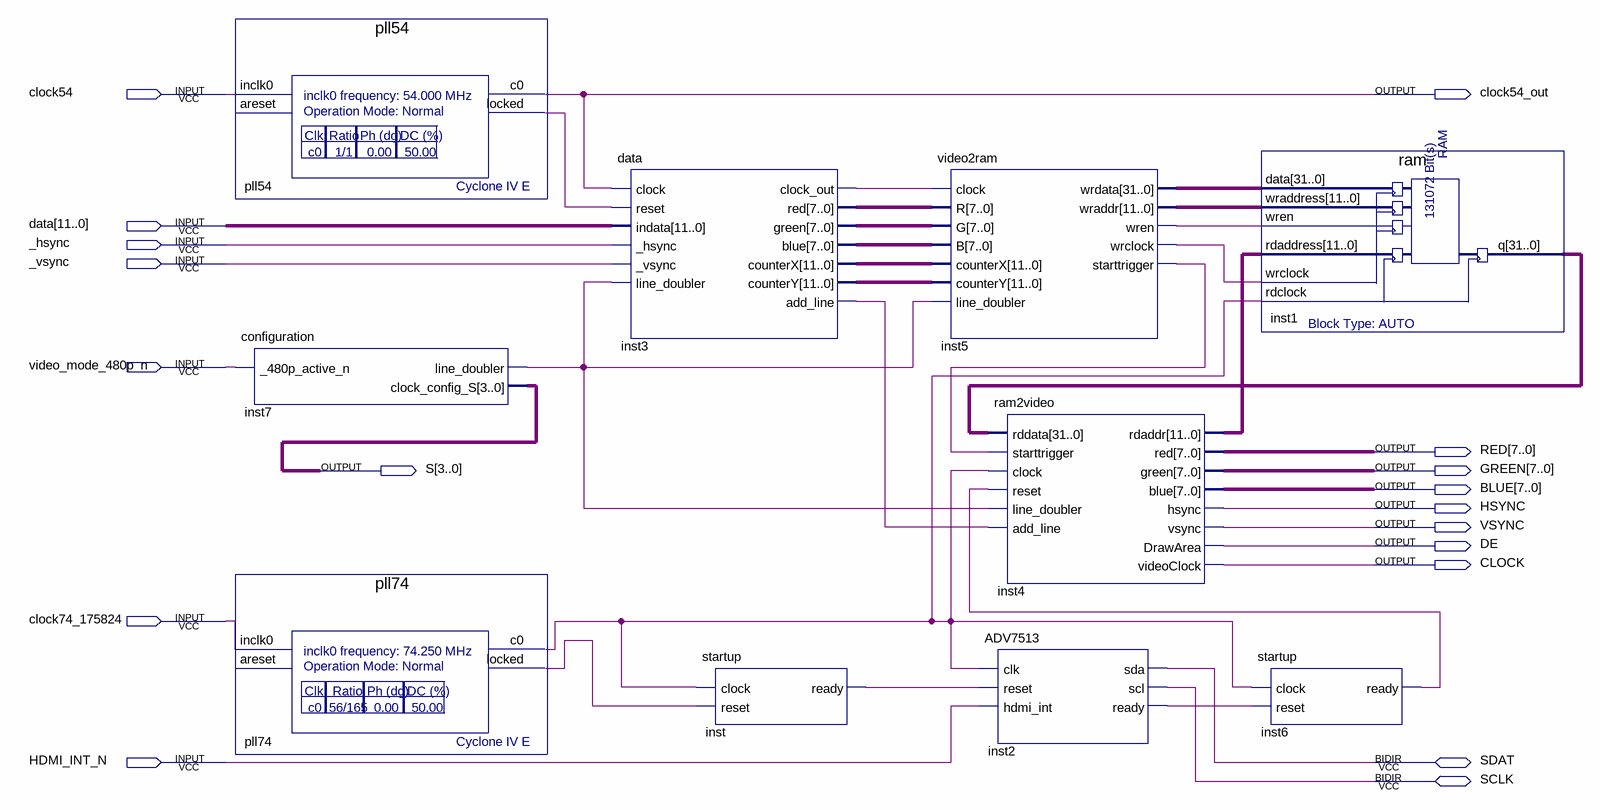
[diagram p0: schematic sheet]
// Quartus schematic DCxPlus.bdf as structural Verilog: 10 symbols, 18 pins
module DCxPlus (
  input  clock54,
  input  [11:0] data,
  input  _hsync,
  input  _vsync,
  input  video_mode_480p_n,
  input  clock74_175824,
  input  HDMI_INT_N,
  inout  SDAT,
  inout  SCLK,
  output clock54_out,
  output [7:0] RED,
  output [3:0] S,
  output [7:0] GREEN,
  output [7:0] BLUE,
  output HSYNC,
  output VSYNC,
  output DE,
  output CLOCK
);

  wire inst2_ready, inst3_add_line, inst3_clock_out, inst5_starttrigger, inst5_wrclock, inst5_wren,
       inst6_ready, inst7_line_doubler, inst_ready, pll54_locked, pll74_c0, pll74_locked;
  wire [7:0] inst3_blue, inst3_green, inst3_red;
  wire [11:0] inst3_counterx, inst3_countery, inst4_rdaddr, inst5_wraddr;
  wire [31:0] inst1_q, inst5_wrdata;

  pll54 pll54 (.inclk0(clock54), .c0(clock54_out), .locked(pll54_locked));  // open: areset
  configuration inst7 (._480p_active_n(video_mode_480p_n), .line_doubler(inst7_line_doubler), .clock_config_S(S));
  pll74 pll74 (.inclk0(clock74_175824), .c0(pll74_c0), .locked(pll74_locked));  // open: areset
  data inst3 (
    .clock(clock54_out), .reset(pll54_locked), .indata(data), ._hsync(_hsync), ._vsync(_vsync),
    .line_doubler(inst7_line_doubler), .clock_out(inst3_clock_out), .red(inst3_red), .green(inst3_green),
    .blue(inst3_blue), .counterX(inst3_counterx), .counterY(inst3_countery), .add_line(inst3_add_line));
  startup inst (.clock(pll74_c0), .reset(pll74_locked), .ready(inst_ready));
  video2ram inst5 (
    .clock(inst3_clock_out), .R(inst3_red), .G(inst3_green), .B(inst3_blue), .counterX(inst3_counterx),
    .counterY(inst3_countery), .line_doubler(inst7_line_doubler), .wrdata(inst5_wrdata),
    .wraddr(inst5_wraddr), .wren(inst5_wren), .wrclock(inst5_wrclock), .starttrigger(inst5_starttrigger));
  ram2video inst4 (
    .rddata(inst1_q), .starttrigger(inst5_starttrigger), .clock(pll74_c0), .reset(inst6_ready),
    .line_doubler(inst7_line_doubler), .add_line(inst3_add_line), .rdaddr(inst4_rdaddr), .red(RED),
    .green(GREEN), .blue(BLUE), .hsync(HSYNC), .vsync(VSYNC), .DrawArea(DE), .videoClock(CLOCK));
  ADV7513 inst2 (
    .clk(pll74_c0), .reset(inst_ready), .hdmi_int(HDMI_INT_N), .ready(inst2_ready), .sda(SDAT), .scl(SCLK));
  ram inst1 (
    .data(inst5_wrdata), .wraddress(inst5_wraddr), .wren(inst5_wren), .rdaddress(inst4_rdaddr),
    .wrclock(inst5_wrclock), .rdclock(pll74_c0), .q(inst1_q));
  startup inst6 (.clock(pll74_c0), .reset(inst2_ready), .ready(inst6_ready));
endmodule
